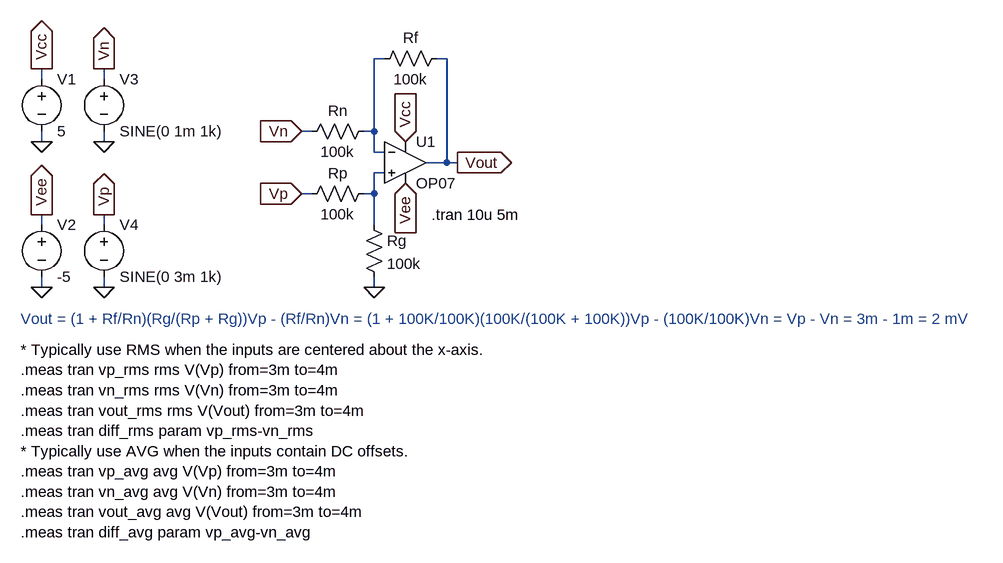
[diagram p0: schematic op-amp_differential_amplifier.asc]
op-amp_differential_amplifier.asc, the LTspice schematic file:
Version 4
SHEET 1 1412 820
WIRE 416 160 400 160
WIRE 512 160 496 160
WIRE -112 192 -112 176
WIRE -16 192 -16 176
WIRE 304 272 288 272
WIRE 400 272 400 160
WIRE 400 272 384 272
WIRE -112 288 -112 272
WIRE -16 288 -16 272
WIRE 400 304 400 272
WIRE 416 304 400 304
WIRE 512 320 512 160
WIRE 512 320 480 320
WIRE 528 320 512 320
WIRE 416 336 400 336
WIRE 304 368 288 368
WIRE 400 368 400 336
WIRE 400 368 384 368
WIRE -112 416 -112 400
WIRE -16 416 -16 400
WIRE 400 416 400 368
WIRE -112 512 -112 496
WIRE -16 512 -16 496
WIRE 400 512 400 496
FLAG 448 288 Vcc
IOPIN 448 288 In
FLAG 448 352 Vee
IOPIN 448 352 In
FLAG 288 272 Vn
IOPIN 288 272 In
FLAG 528 320 Vout
IOPIN 528 320 Out
FLAG -112 288 0
FLAG -112 512 0
FLAG -16 288 0
FLAG -112 176 Vcc
IOPIN -112 176 Out
FLAG -112 400 Vee
IOPIN -112 400 Out
FLAG -16 176 Vn
IOPIN -16 176 Out
FLAG 400 512 0
FLAG 288 368 Vp
IOPIN 288 368 In
FLAG -16 512 0
FLAG -16 400 Vp
IOPIN -16 400 Out
SYMBOL OpAmps/OP07 448 256 R0
SYMATTR InstName U1
SYMBOL res 512 144 R90
WINDOW 0 0 56 VBottom 2
WINDOW 3 32 56 VTop 2
SYMATTR InstName Rf
SYMATTR Value 100k
SYMBOL voltage -112 176 R0
SYMATTR InstName V1
SYMATTR Value 5
SYMBOL voltage -112 400 R0
SYMATTR InstName V2
SYMATTR Value -5
SYMBOL voltage -16 176 R0
SYMATTR InstName V3
SYMATTR Value SINE(0 1m 1k)
SYMBOL res 400 256 R90
WINDOW 0 0 56 VBottom 2
WINDOW 3 32 56 VTop 2
SYMATTR InstName Rn
SYMATTR Value 100k
SYMBOL res 400 352 R90
WINDOW 0 0 56 VBottom 2
WINDOW 3 32 56 VTop 2
SYMATTR InstName Rp
SYMATTR Value 100k
SYMBOL res 384 400 R0
SYMATTR InstName Rg
SYMATTR Value 100k
SYMBOL voltage -16 400 R0
SYMATTR InstName V4
SYMATTR Value SINE(0 3m 1k)
TEXT -144 608 Left 2 !* Typically use RMS when the inputs are centered about the x-axis.\n.meas tran vp_rms rms V(Vp) from=3m to=4m\n.meas tran vn_rms rms V(Vn) from=3m to=4m\n.meas tran vout_rms rms V(Vout) from=3m to=4m\n.meas tran diff_rms param vp_rms-vn_rms\n* Typically use AVG when the inputs contain DC offsets.\n.meas tran vp_avg avg V(Vp) from=3m to=4m\n.meas tran vn_avg avg V(Vn) from=3m to=4m\n.meas tran vout_avg avg V(Vout) from=3m to=4m\n.meas tran diff_avg param vp_avg-vn_avg
TEXT -144 560 Left 2 ;Vout = (1 + Rf/Rn)(Rg/(Rp + Rg))Vp - (Rf/Rn)Vn = (1 + 100K/100K)(100K/(100K + 100K))Vp - (100K/100K)Vn = Vp - Vn = 3m - 1m = 2 mV
TEXT 488 400 Left 2 !.tran 10u 5m

The netlist it stands for:
* op-amp_differential_amplifier.asc
XU1 N002 N001 Vcc Vee Vout LT1001  ; OP07, pins In+ In- V+ V- OUT
Rf Vout N001 100k
V1 Vcc 0 5
V2 Vee 0 -5
V3 Vn 0 SINE(0 1m 1k)
Rn N001 Vn 100k
Rp N002 Vp 100k
Rg N002 0 100k
V4 Vp 0 SINE(0 3m 1k)
* Typically use RMS when the inputs are centered about the x-axis.
.meas tran vp_rms rms V(Vp) from=3m to=4m
.meas tran vn_rms rms V(Vn) from=3m to=4m
.meas tran vout_rms rms V(Vout) from=3m to=4m
.meas tran diff_rms param vp_rms-vn_rms
* Typically use AVG when the inputs contain DC offsets.
.meas tran vp_avg avg V(Vp) from=3m to=4m
.meas tran vn_avg avg V(Vn) from=3m to=4m
.meas tran vout_avg avg V(Vout) from=3m to=4m
.meas tran diff_avg param vp_avg-vn_avg
* Vout = (1 + Rf/Rn)(Rg/(Rp + Rg))Vp - (Rf/Rn)Vn = (1 + 100K/100K)(100K/(100K + 100K))Vp - (100K/100K)Vn = Vp - Vn = 3m - 1m = 2 mV
.tran 10u 5m
.lib LTC.lib
.backanno
.end